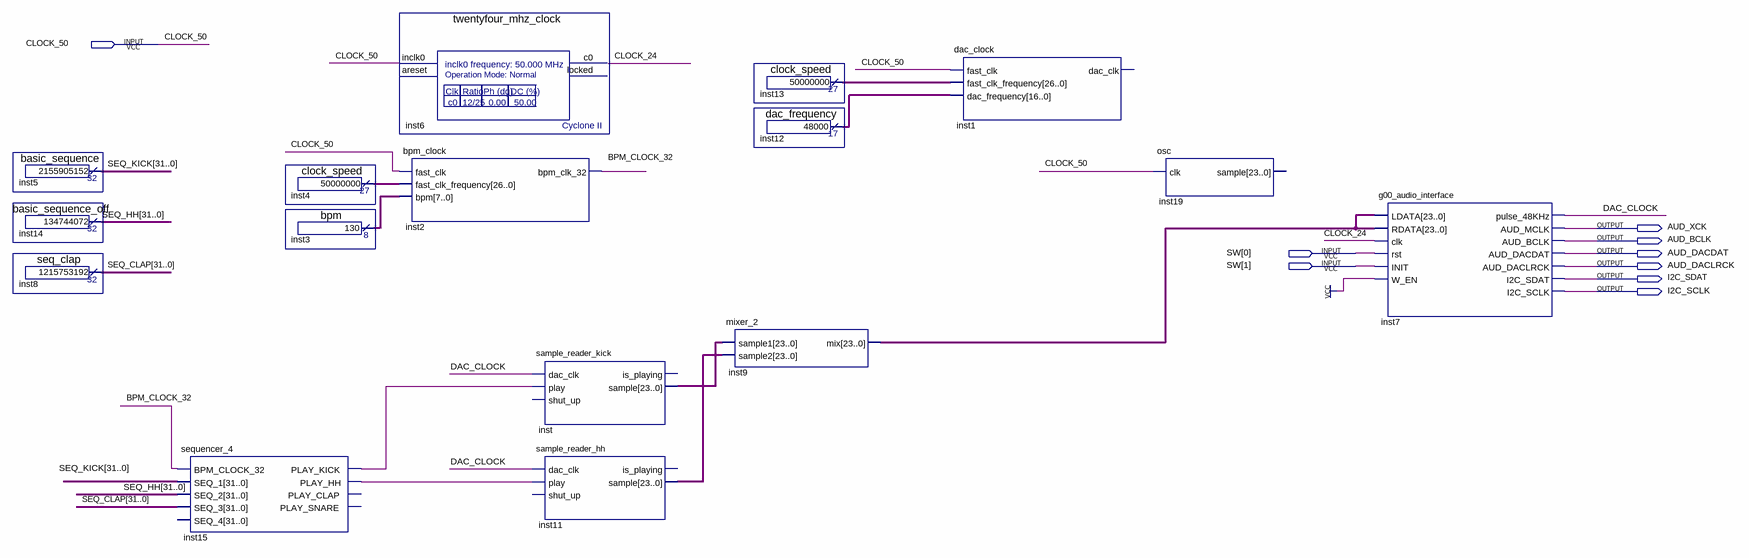
[diagram p0: schematic sheet]
// Quartus schematic main_small.bdf as structural Verilog: 16 symbols, 9 pins
module main_small (
  input  CLOCK_50,
  input  [1:0] SW,
  output AUD_XCK,
  output AUD_BCLK,
  output AUD_DACDAT,
  output AUD_DACLRCK,
  output I2C_SDAT,
  output I2C_SCLK
);

  wire BPM_CLOCK_32, CLOCK_24, DAC_CLOCK, inst15_play_hh, inst15_play_kick;
  wire [7:0] inst3_result;
  wire [16:0] inst12_result;
  wire [23:0] inst9_mix, inst11_sample, inst_sample;
  wire [26:0] inst4_result, inst13_result;
  wire [31:0] SEQ_CLAP, SEQ_HH, SEQ_KICK;

  basic_sequence inst5 (.result(SEQ_KICK));
  basic_sequence_off inst14 (.result(SEQ_HH));
  seq_clap inst8 (.result(SEQ_CLAP));
  sequencer_4 inst15 (
    .BPM_CLOCK_32(BPM_CLOCK_32), .SEQ_1(SEQ_KICK), .SEQ_2(SEQ_HH), .SEQ_3(SEQ_CLAP),
    .PLAY_KICK(inst15_play_kick), .PLAY_HH(inst15_play_hh));  // open: SEQ_4, PLAY_CLAP, PLAY_SNARE
  clock_speed inst4 (.result(inst4_result));
  bpm inst3 (.result(inst3_result));
  twentyfour_mhz_clock inst6 (.inclk0(CLOCK_50), .c0(CLOCK_24));  // open: areset, locked
  bpm_clock inst2 (
    .fast_clk(CLOCK_50), .fast_clk_frequency(inst4_result), .bpm(inst3_result), .bpm_clk_32(BPM_CLOCK_32));
  sample_reader_kick inst (
    .dac_clk(DAC_CLOCK), .play(inst15_play_kick), .sample(inst_sample));  // open: shut_up, is_playing
  sample_reader_hh inst11 (
    .dac_clk(DAC_CLOCK), .play(inst15_play_hh), .sample(inst11_sample));  // open: shut_up, is_playing
  mixer_2 inst9 (.sample1(inst_sample), .sample2(inst11_sample), .mix(inst9_mix));
  clock_speed inst13 (.result(inst13_result));
  dac_frequency inst12 (.result(inst12_result));
  dac_clock inst1 (
    .fast_clk(CLOCK_50), .fast_clk_frequency(inst13_result), .dac_frequency(inst12_result));  // open: dac_clk
  osc inst19 (.clk(CLOCK_50));  // open: sample
  g00_audio_interface inst7 (
    .LDATA(inst9_mix), .RDATA(inst9_mix), .clk(CLOCK_24), .rst(SW[0]), .INIT(SW[1]), .W_EN(1'b1),
    .pulse_48KHz(DAC_CLOCK), .AUD_MCLK(AUD_XCK), .AUD_BCLK(AUD_BCLK), .AUD_DACDAT(AUD_DACDAT),
    .AUD_DACLRCK(AUD_DACLRCK), .I2C_SDAT(I2C_SDAT), .I2C_SCLK(I2C_SCLK));
endmodule
